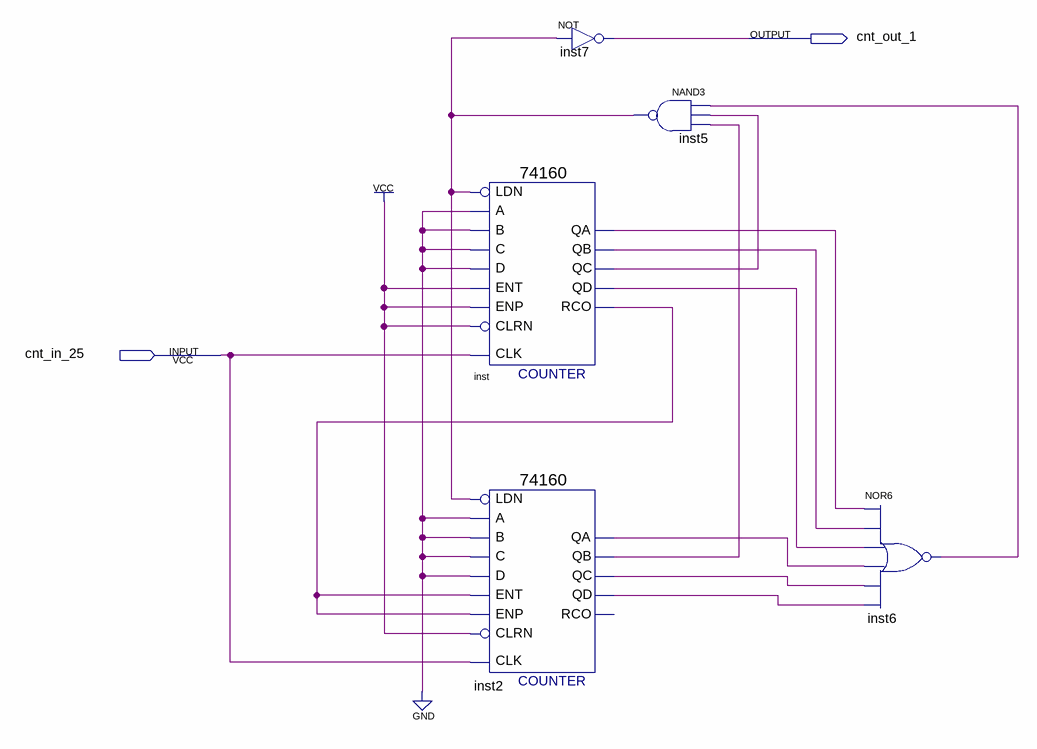
[diagram p0: schematic sheet]
// Quartus schematic cnt25.bdf as structural Verilog: 5 symbols, 2 pins
module cnt25 (
  input  cnt_in_25,
  output cnt_out_1
);

  wire inst2_qa, inst2_qb, inst2_qc, inst2_qd, inst5_out, inst6_out, inst_qa, inst_qb, inst_qc, inst_qd,
       inst_rco;

  \74160  inst (
    .CLK(cnt_in_25), .ENT(1'b1), .A(1'b0), .B(1'b0), .C(1'b0), .D(1'b0), .LDN(inst5_out), .ENP(1'b1),
    .CLRN(1'b1), .QD(inst_qd), .QA(inst_qa), .QB(inst_qb), .QC(inst_qc), .RCO(inst_rco));
  \74160  inst2 (
    .CLK(cnt_in_25), .ENT(inst_rco), .A(1'b0), .B(1'b0), .C(1'b0), .D(1'b0), .LDN(inst5_out), .ENP(inst_rco),
    .CLRN(1'b1), .QD(inst2_qd), .QA(inst2_qa), .QB(inst2_qb), .QC(inst2_qc));  // open: RCO
  not inst7 (cnt_out_1, inst5_out);
  nand inst5 (inst5_out, inst6_out, inst_qc, inst2_qb);
  nor inst6 (inst6_out, inst_qa, inst_qb, inst_qd, inst2_qa, inst2_qc, inst2_qd);
endmodule
